# EAGLE design tm7_dock (EAGLE 9.6.2)
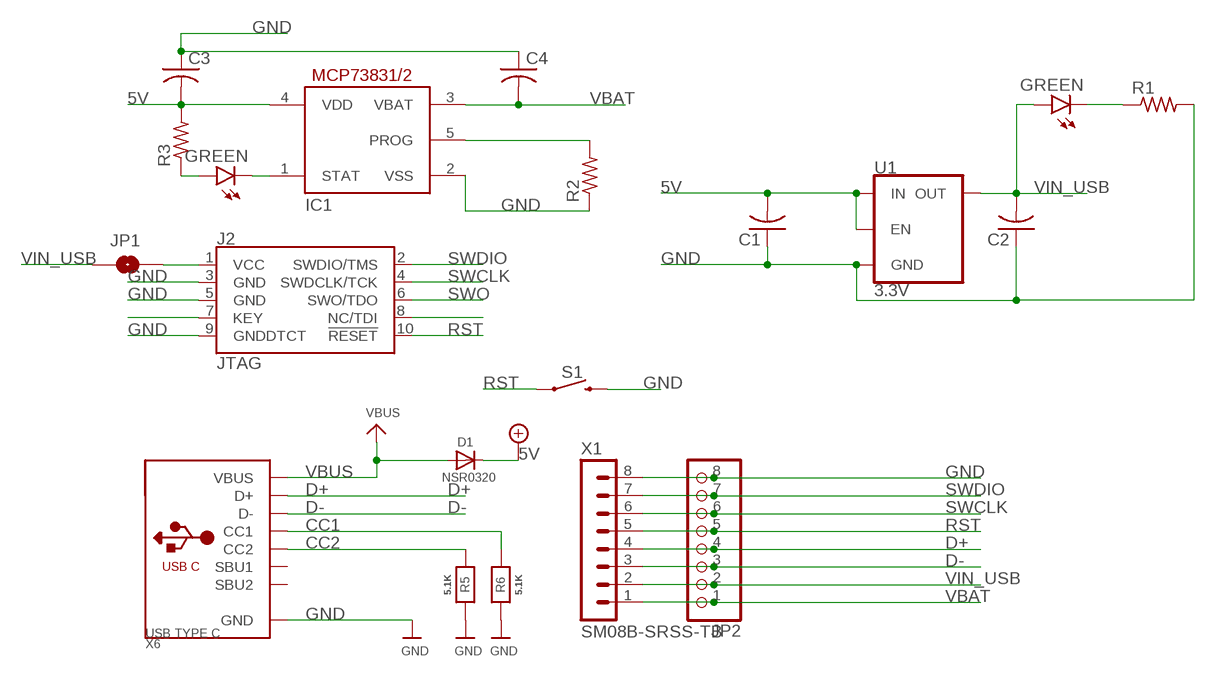
[diagram p0: schematic, sheet 1]

## Parts
C1  C-USC0603  [C0603]
C2  C-USC0603  [C0603]
C3  C-USC0603  [C0603]
C4  C-USC0603  [C0603]
D1  NSR0320  DIODE_SOD323MINI  [SOD-323_MINI]
D2  GREEN  LED-GREEN1206  [LED-1206]
D3  GREEN  LED-GREEN1206  [LED-1206]
IC1  MCP73831/OT  [SOT23-5L]
J2  JTAG  CORTEX_JTAG_DEBUG_SMD  [2X5-SMD-1.27MM]
JP1  JUMPER-SMT_2_NO_NO-SILK  [SMT-JUMPER_2_NO_NO-SILK]
JP2  PINHD-1X8LOCK  [1X08-LOCK]
R1  R-US_R0603  [R0603]
R2  R-US_R0603  [R0603]
R3  R-US_R0603  [R0603]
R5  5.1K  RESISTOR_0402NO  [_0402NO]
R6  5.1K  RESISTOR_0402NO  [_0402NO]
S1  MOMENTARY-SWITCH-SPST-SMD-5.2MM-TALL  [TACTILE_SWITCH_SMD_5.2MM]
U1  3.3V  V_REG_AP2112K-3.3V  [SOT23-5]
X1  SM08B-SRSS-TB  [SM08B-SRSS-TB]
X6  USB TYPE C  USB_C  [USB_C_CUSB31-CFM2AX-01-X]

## Nets
5V [power]: C1.2 C3.2 D1.C IC1.4(VDD) R3.2 U1.1(IN) U1.3(EN) ; supply symbol labelled +5V
CC1: R6.2 X6.A5(CC1)
CC2: R5.2 X6.B5(CC2)
D+: JP2.4 X1.4 X6.A6(D+) X6.B6(D+)
D-: JP2.3 X1.3 X6.A7(D-) X6.B7(D-)
GND [power]: C1.1 C2.1 C3.1 C4.1 IC1.2(VSS) J2.3(GND) J2.5(GND) J2.9(GNDDTCT) JP2.8 R1.2 R2.1 R5.1 R6.1 S1.3 U1.2(GND) X1.8 X6.A1B12(GND) X6.B1A12(GND)
N$1: D2.C R1.1
N$2: IC1.5(PROG) R2.2
N$3: D3.C IC1.1(STAT)
N$4: J2.7(KEY)
N$5: D3.A R3.1
N$6: J2.1(VCC) JP1.2
N$9: J2.8(NC/TDI)
RST: J2.10(!RESET) JP2.5 S1.1 X1.5
SWCLK: J2.4(SWDCLK/TCK) JP2.6 X1.6
SWDIO: J2.2(SWDIO/TMS) JP2.7 X1.7
SWO: J2.6(SWO/TDO)
VBAT: C4.2 IC1.3(VBAT) JP2.1 X1.1
VBUS [power]: D1.A X6.A4B9(VBUS) X6.B4A9(VBUS)
VIN_USB: C2.2 D2.A JP1.1 JP2.2 U1.5(OUT) X1.2
Unconnected: X6.A8(SBU1) X6.B8(SBU2)

## Library data of the parts
C1-C4 = adafruit:C-US: CAPACITOR, American symbol
D1 = microbuilder:DIODE: Diode SMA Model Volts Amps Type Vf Ir Digikey # Notes SSA34-E3 40V 3A Schottky 480mV @ 3A 200uA @ 40V SSA34-E3/61TGITR-ND CDBA120-G 20V 1A Schottky 500mV @ 1A 500uA @ 20V 641-1014-6-ND REEL MBRA210 10V 2A Schottky 350mV @ 2A 700uA @ 10V MBRA210LT3 SOD-123 Model Volts Amps Type Vf Ir Order # Notes BAT54T1G 30V 200mA Schottky 800mV @ 200mA 2uA @ 25V BAT54T1GOSTR-ND B0530W 30V 500mA Schottky 430mV @ 500mA 130uA @ 30V B0530W-FDICT-ND REEL MBR120 20V 1A Schottky 340mV @ 1A MBR120VLSFT1GOSCT-ND SOD-323 Model Volts Amps Type Vf Ir Order # Notes PMEG2005EJ 20V 500mA Schottky 355mV @ 500mA 568-4110-1-ND ZLLS410 10V 570mA Schottky 380mV @ 570mA ZLLS410CT-ND 1N4148WS 75V 150mA Silicon/Simple 1V 1N4148WSFSCT-ND REEL SOD-523 Model Volts Amps Type Vf Ir Order # Notes BAT54XV2 30V 200mA Schottky 0.8V @ 100mA BAT54XV2CT-ND TB751S 30V 30mA Schottky RB751S-40TE61CT-ND SOT23-R/W (R = Solder Paste/Reflow Ovens, W = Hand-Soldering) Model Volts Amps Type Vf Ir Order # Notes BAT54FILM 40V 300mA Schottky 497-7162-1-ND POWERDI-5 Model Volts Amps Type Vf Ir Order # Notes PDS560 60V 5A Schottky 670mV @ 5A 150uA @ 60V PDS560DICT-ND
D2 D3 = SparkFun-LED:LED-GREEN: Green SMD LED Used in manufacturing of various products at SparkFun Packages: 0603 - SMD 0603 package [Product Link] <http://www.futureelectronics.com/en/technologies/semiconductors/optoelectronics/leds/Pages/9894312-LTST-C190GKT.aspx?CrossPart=HSMG-C190&IM=0> LilyPad 1206 - SMD1206 LilyPad package [Product Link] <http://www.futureelectronics.com/en/Technologies/Product.aspx?ProductID=IN150NGHARVATEKCORPORATION2049943&IM=0> 1206 - SMD1206 package [Product Link] <http://www.futureelectronics.com/en/technologies/semiconductors/optoelectronics/leds/Pages/8315665-LTST-C150KGKT.aspx?IM=0> 1206 Bottom Mount -SMD 1206 Bottom Mount [Product Link] <http://www.digikey.com/product-detail/en/lite-on-inc/LTST-C230KGKT/160-1456-1-ND/386854> SparkFun Products: Pro Mini 328 -5V <https://www.sparkfun.com/products/821> RedBoard <https://www.sparkfun.com/products/12757> MP3 Trigger <https://www.sparkfun.com/products/13720> Makey Makey <https://www.sparkfun.com/products/11076>; PROD_ID: DIO-00862
IC1 = adafruit:MCP73831: MCP73831/2 Miniature Single-Cell, Fully Integrated Li-Ion, Li-Polymer Charge Management Controllers. Nice and small simple lipoly charge controller, with adjustable current and status output (LED) http://www.ladyada.net/library/pcb/eaglelibrary.html
J2 = SparkFun-Connectors:CORTEX_JTAG_DEBUG: Cortex Debug Connector - 10 pin Supports JTAG debug, Serial Wire debug, and Serial Wire Viewer. PTH and SMD connector options available. General Connector Information <http://infocenter.arm.com/help/topic/com.arm.doc.faqs/attached/13634/cortex_debug_connectors.pdf> Products: PTH Connector <http://www.digikey.com/product-detail/en/cnc-tech/3220-10-0100-00/1175-1627-ND/3883661> -via Digi-Key SparkFun PSoc <https://www.sparkfun.com/products/13229> SparkFun T <https://www.sparkfun.com/products/13810>; PROD_ID: CONN-14503
JP1 = SparkFun-Jumpers:JUMPER-SMT_2_NO: Normally open jumper This jumper has two pads in close proximity to each other. Apply solder to close the connection. Round pads are easier to solder for beginners, but are a lot larger. SparkFun Product that uses the round pads: SparkFun EL Sequencer <https://www.sparkfun.com/products/12781>
JP2 = adafruit:PINHD-1X8: PIN HEADER
R1-R3 = adafruit:R-US_: RESISTOR, American symbol
R5 R6 = microbuilder:RESISTOR: Resistors For new designs, use the packages preceded by an '_' character since they are more reliable: The following footprints should be used on most boards: _0402 - Standard footprint for regular board layouts _0603 - Standard footprint for regular board layouts _0805 - Standard footprint for regular board layouts _1206 - Standard footprint for regular board layouts For extremely tight-pitch boards where space is at a premium, the following 'micro-pitch' footprints can be used (smaller pads, no silkscreen outline, etc.): _0402MP - Micro-pitch footprint for very dense/compact boards _0603MP - Micro-pitch footprint for very dense/compact boards _0805MP - Micro-pitch footprint for very dense/compact boards _1206MP - Micro-pitch footprint for very dense/compact boards
S1 = SparkFun-Switches:MOMENTARY-SWITCH-SPST: Momentary Switch (Pushbutton) - SPST Normally-open (NO) SPST momentary switches (buttons, pushbuttons). Variants PTH-12MM - 12mm square, through-hole Momentary Pushbutton Switch - 12mm Square <https://www.sparkfun.com/products/9190> (COM-09190) PTH-6.0MM, PTH-6.0MM-KIT - 6.0mm square, through-hole Mini Pushbutton Switch <https://www.sparkfun.com/products/97> (COM-00097) KIT package intended for soldering kit's - only one side of pads' copper is exposed. PTH-RIGHT-ANGLE-KIT - Right-angle, through-hole Right Angle Tactile Button <https://www.sparkfun.com/products/10791> - Used on SparkFun BigTime Watch Kit <https://www.sparkfun.com/products/11734> SMD-12MM - 12mm square, surface-mount Tactile Button - SMD (12mm) <https://www.sparkfun.com/products/12993> (COM-12993) Used on SparkFun PicoBoard <https://www.sparkfun.com/products/11888> SMD-4.5MM - 4.5mm Square Trackball Switch Used on SparkFun Blackberry Trackballer Breakout <https://www.sparkfun.com/products/13169> SMD-4.6MMX2.8MM - 4.60mm x 2.80mm, surface mount Used on SparkFun Pro Micro - RP2040 <https://www.sparkfun.com/products/17717> SMD-5.2MM, SMD-5.2-REDUNDANT - 5.2mm square, surface-mount Mini Pushbutton Switch - SMD <https://www.sparkfun.com/products/8720> (COM-08720) Used on Arduino Pro Mini <https://www.sparkfun.com/products/11114> REDUNDANT package connects both switch circuits together SMD-6.0X3.5MM - 6.0 x 3.5mm, surface mount Momentary Reset Switch SMD <https://www.sparkfun.com/products/8229> (COM-08229) SMD-6.2MM-TALL - 6.2mm square, surface mount Tactile Button - SMD (6mm) <https://www.sparkfun.com/products/12992> Used on SparkFun Digital Sandbox <https://www.sparkfun.com/products/12651> SMD-RIGHT-ANGLE - Right-angle, surface mount Used on SparkFun Block for Intel® Edison - Arduino <https://www.sparkfun.com/products/13036>; PROD_ID: SWCH-14139
U1 = SparkFun-IC-Power:V_REG_AP2112: AP2112 - 600mA CMOS LDO Regulator w/ Enable The AP2112 is CMOS process low dropout linear regulator with enable function, the regulator delivers a guaranteed 600mA (min.) continuous load current. Features Output Voltage Accuracy: ±1.5% Output Current: 600mA (Min.) Foldback Short Current Protection: 50mA Enable Function to Turn ON/OFF VOUT Low Dropout Voltage (3.3V): 250mV (Typ.) @IOUT=600mA Excellent Load Regulation: 0.2%/A (Typ.) Excellent Line Regulation: 0.02%/V (Typ.) Low Quiescent Current: 55μA (Typ.) Low Standby Current: 0.01μA (Typ.) Low Output Noise: 50μVRMS PSRR: 100Hz -65dB, 1kHz -65dB OTSD Protection Stable with 1.0μF Flexible Cap: Ceramic, Tantalum and Aluminum Electrolytic Operation Temperature Range: -40°C to 85°C ESD: MM 400V, HBM 4000V; PROD_ID: VREG-12457
X1 = con-JST:SM08B-SRSS: JST SH series header 1.00mm pitch disconnectable crimp style connectors, horizontal (side entry type), 8 pins
X6 = microbuilder:USB_C: USB Type-C USB 2.0 Connector

## Net classes
1 power: width 0.254 mm

## Board
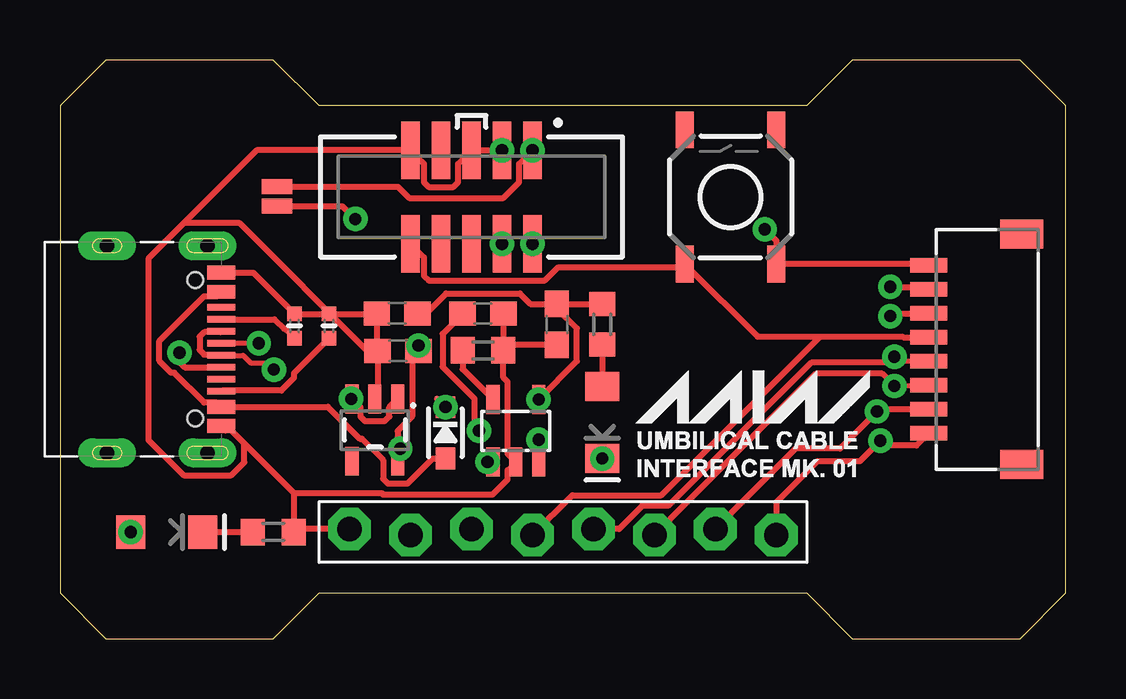
[diagram p1: board, top side]
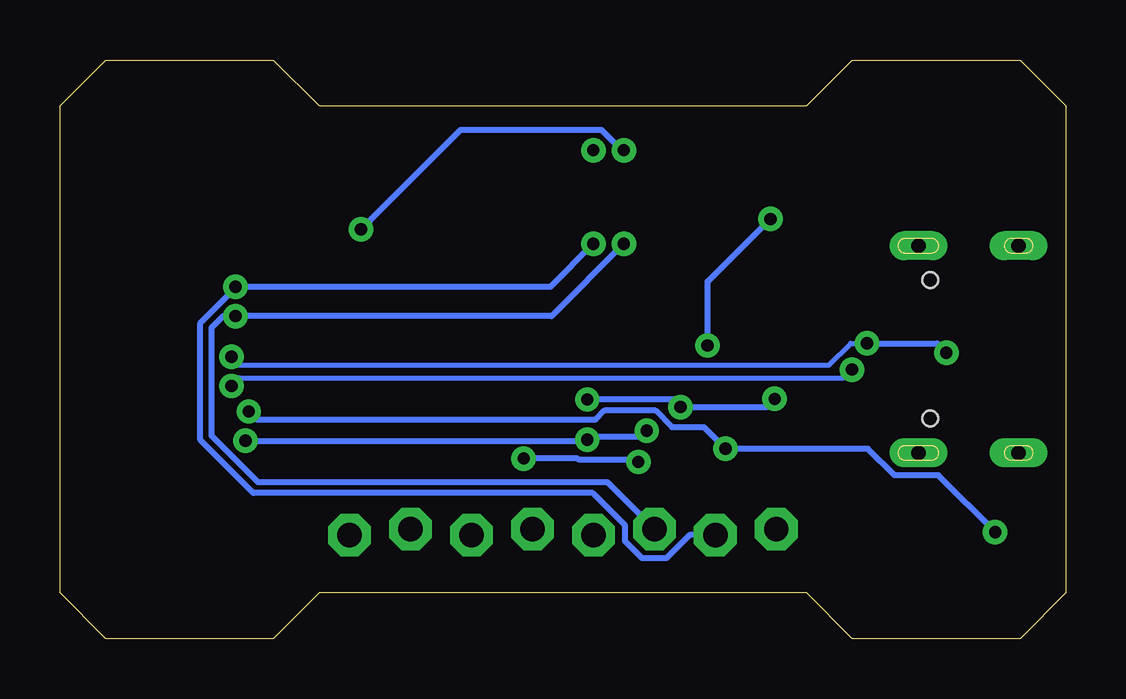
[diagram p2: board, bottom side, seen from below]

Size 41.91 x 24.13 mm. Coordinates in mm from the lower left corner, seen from the top.
Outline: 0,1.9 1.91,0 8.89,0 10.79,1.9 31.11,1.9 33.02,0 40,0 41.91,1.9 41.91,22.22 40,24.13 33.02,24.13 31.11,22.22 10.79,22.22 8.89,24.13 1.91,24.13 0,22.22 0,1.9
Copper layers (1*16): Top 0.035mm / dielectric 1.5mm / Bottom 0.035mm
Design rules "SparkFun": minimum track width 8mil, minimum drill 20mil, track to track 8mil, track to pad 8mil, pad to pad 8mil, via to via 8mil, smd to smd 8mil, copper to edge 10mil, drill to drill 8mil, minimum pad ring 12mil, minimum via ring 10mil, stop-mask expansion 4mil, vias tented up to drill 25mil, thermal gap 10mil

### Footprints (pad centres in the part's own frame; a part is rotated, then mirrored left to right if it is on the bottom)
C0603 = smd 1.1 x 1: 1 -0.85,0; 2 0.85,0
SOD-323_MINI = smd 0.9 x 0.8: A 1.07,0; C -1.07,0
LED-1206 = smd 1.2 x 1.4: A -1.5,0; C 1.5,0
SOT23-5L = smd 0.55 x 1.2: 1 -0.95,-1.3; 2 0,-1.3; 3 0.95,-1.3; 4 0.95,1.3; 5 -0.95,1.3
2X5-SMD-1.27MM = smd 0.76 x 2.4: 1 2.54,1.95; 2 2.54,-1.95; 3 1.27,1.95; 4 1.27,-1.95; 5 0,1.95; 6 0,-1.95; 7 -1.27,1.95; 8 -1.27,-1.95; 9 -2.54,1.95; 10 -2.54,-1.95
SMT-JUMPER_2_NO_NO-SILK = smd 0.635 x 1.27: 1 -0.406,0; 2 0.406,0
1X08-LOCK = drill 1.016 pad 1.778 octagon: 1 -8.89,0.127; 2 -6.35,-0.127; 3 -3.81,0.127; 4 -1.27,-0.127; 5 1.27,0.127; 6 3.81,-0.127; 7 6.35,0.127; 8 8.89,-0.127
R0603 = smd 1 x 1.1: 1 -0.85,0; 2 0.85,0
_0402NO = smd 0.6 x 0.6: 1 -0.508,0; 2 0.508,0
TACTILE_SWITCH_SMD_5.2MM = smd 1.524 x 0.762: 1 -2.794,1.905; 2 2.794,1.905; 3 -2.794,-1.905; 4 2.794,-1.905
SOT23-5 = smd 0.55 x 1.2: 1 -0.95,-1.3; 2 0,-1.3; 3 0.95,-1.3; 4 0.95,1.3; 5 -0.95,1.3
SM08B-SRSS-TB = smd 0.6 x 1.55: 1 3.5,0; 2 2.5,0; 3 1.5,0; 4 0.5,0; 5 -0.5,0; 6 -1.5,0; 7 -2.5,0; 8 -3.5,0 | smd 1.2 x 1.8: M1 4.8,3.875; M2 -4.8,3.875
USB_C_CUSB31-CFM2AX-01-X = smd 0.575 x 1.15: A1B12 -3.2,3.545; A4B9 -2.4,3.545; B1A12 3.2,3.545; B4A9 2.4,3.545 | smd 0.275 x 1.15: A5 -1.25,3.545; A6 -0.25,3.545; A7 0.25,3.545; A8 1.25,3.545; B5 1.75,3.545; B6 0.75,3.545; B7 -0.75,3.545; B8 -1.75,3.545 | drill 0.6 pad 1 long: M1 -4.32,2.97; M2 4.32,2.97; M3 -4.32,-1.21; M4 4.32,-1.21 | hole 0.65: 2.89,2.47; -2.89,2.47

### Placement (x,y rotation side)
C1  14.05,13.56 0 top
C2  14.08,12 0 top
C3  20.71,13.11 90 top
C4  17.62,13.56 180 top
D1  16.06,8.59 270 top
D2  4.45,4.45 0 top
D3  22.59,9.01 270 top
IC1  18.99,8.67 0 top
J2  17.14,18.42 0 top
JP1  9.05,18.44 90 top
JP2  20.96,4.45 180 top
R1  8.89,4.45 0 top
R2  17.62,12.02 180 top
R3  22.59,13.11 90 top
R5  11.21,13.04 270 top
R6  9.77,13.04 270 top
S1  27.94,18.42 90 top
U1  13.12,8.7 180 top
X1  36.19,12.07 270 top
X6  3.18,12.07 270 top

### Tracks (layer width: path | path; a pad name or v marks a point on that pad's centre or on a via)
5V  (via drill 0.51)
  Top 0.254: 15.71,10 D1.C | IC1.4 v19.94,9.97 21.54,11.57 21.54,12.94 20.71,13.77 C3.2 | C3.2 R3.2 | v12.13,10 U1.3 12.51,9.65 12.51,9.26 12.71,9.07 13.53,9.07 13.72,9.26 13.72,9.65 U1.1 | C1.2 15.25,13.56 16.08,14.39 19.16,14.39 19.6,13.96 C3.2
  Bottom 0.254: v12.13,10 12.48,9.65 D1.C 16.38,9.97 v19.94,9.97
  other vias: 16.06,9.66
CC1
  Top 0.254: R6.2 9.39,12.91 9.34,12.91 8.93,13.31 X6.A5
CC2
  Top 0.254: X6.B5 6.75,10.35 9.22,10.35 9.75,10.87 9.75,11.06 R5.2
D+  (via drill 0.51)
  Top 0.203: X1.4 34.95,11.56 v34.77,11.75 | v8.28,12.31 X6.A6
  Top 0.254: v4.98,11.92 4.98,11.54 5.2,11.31 X6.B6 | 34.59,11.58 v34.77,11.75 34.52,11.51 31.31,11.51 25.34,5.54 24.26,5.54 23.29,4.57 JP2.4
  Bottom 0.203: v34.77,11.75 34.42,11.41 9.87,11.41 8.97,12.31 v8.28,12.31
  Bottom 0.254: v8.28,12.31 5.37,12.31 v4.98,11.92
D-  (via drill 0.51)
  Top 0.203: X6.A7 7.63,11.81 7.95,11.5 8.63,11.5 v8.91,11.22 | v34.77,10.53 34.8,10.56 X1.3
  Top 0.254: X6.B7 6.69,12.78 6.01,12.78 5.82,12.59 5.82,12.04 6.01,11.85 6.69,11.85 X6.A7 | v34.77,10.53 34.25,11.05 31.5,11.05 JP2.3
  Bottom 0.203: v8.91,11.22 9.25,10.88 34.42,10.88 v34.77,10.53
GND  (via drill 0.51)
  Top 0.254: X6.A1B12 8.05,15.26 R6.1 R5.1 13.18,13.54 C1.1 13.2,12.04 C2.1 | C2.1 13.23,10.11 U1.2 | R2.1 18.71,12.26 C3.1 | C4.1 R2.1 | R2.1 18.47,10.88 18.65,10.7 18.65,7.71 IC1.2 18.65,7.02 18.65,6.63 18.03,6.01 13.47,6.01 13.4,6.08 9.74,6.08 | JP2.8 9.87,4.57 R1.2 9.74,6.08 | X6.B1A12 6.91,8.68 7.14,8.68 7.68,8.13 | 7.68,8.13 9.74,6.08 | X1.8 36.14,15.62 S1.3 29.85,16.59 v29.37,17.07 | J2.3 J2.5 16.59,19.8 16.59,19.03 16.39,18.83 15.36,18.83 15.17,19.03 15.17,19.8 15.06,19.91 J2.9 8.2,20.36 5.15,17.32 | 7.68,8.13 7.68,7.36 7.14,6.81 5.15,6.81 3.68,8.28 3.68,15.85 5.15,17.32 | C2.1 12.81,12 7.49,17.32 5.15,17.32
  Bottom 0.254: J2.3 18.5,20.36 19.34,21.2 25.23,21.2 v29.37,17.07
  other vias: 18.42,20.36
N$1
  Top 0.254: D2.C R1.1
N$2
  Top 0.254: R2.2 16.77,11.24 IC1.5
N$3  (via drill 0.51)
  Top 0.254: IC1.1 v17.81,7.37
  Bottom 0.254: D3.C 20.34,7.51 20.29,7.46 17.9,7.46 v17.81,7.37
  other vias: 22.59,7.51
N$5
  Top 0.254: R3.1 D3.A
N$6  (via drill 0.51)
  Top 0.254: JP1.2 14.08,18.85 14.54,18.38 18.47,18.38 19.13,19.03 19.13,19.8 J2.1
  other vias: 19.68,20.36
RST
  Top 0.254: JP2.5 21.35,5.98 25.06,5.98 31.67,12.59 | X1.5 35.14,12.56 35.11,12.59 31.67,12.59 | 31.67,12.59 29.06,12.59 26.16,15.49 | S1.1 26.16,15.49 | J2.10 15.17,15.9 15.17,15.13 15.36,14.93 20.2,14.93 20.76,15.49 26.16,15.49
SWCLK  (via drill 0.51)
  Top 0.254: v34.59,13.45 34.71,13.56 X1.6
  Bottom 0.254: J2.4 21.43,13.45 v34.59,13.45 35.11,13.45 35.6,12.96 35.6,8.47 33.66,6.53 19.1,6.53 JP2.6
  other vias: 18.42,16.46
SWDIO  (via drill 0.51)
  Top 0.254: v34.59,14.67 36.09,14.67 X1.7
  Bottom 0.254: J2.2 21.48,14.67 v34.59,14.67 34.59,14.63 36.06,13.17 36.06,8.28 33.85,6.07 19.71,6.07 18.36,4.72 18.36,4.07 17.65,3.35 16.64,3.35 15.68,4.32 JP2.7
  other vias: 19.68,16.46
VBAT  (via drill 0.51)
  Top 0.254: v17.46,8.67 17.27,8.86 17.27,10.01 15.94,11.33 15.94,12.71 16.77,13.54 C4.2 | JP2.1 29.85,5.69 31.55,7.4 33.32,7.4 v34.18,8.25 34.39,8.05 35.68,8.05 X1.1 | IC1.3 v19.94,8.3 | v19.94,8.3
  Bottom 0.254: v34.18,8.25 19.99,8.25 v19.94,8.3 19.94,8.33 19.85,8.43 17.7,8.43 v17.46,8.67
VBUS
  Top 0.254: D1.A 15.53,7.51 14.48,6.47 13.66,6.47 13.46,6.66 13.46,7.45 12.58,8.33 12.5,8.33 11.16,9.66 X6.B4A9 6.54,9.85 6.01,9.85 4.77,11.09 4.63,11.09 4.14,11.58 4.14,12.41 6.01,14.28 6.54,14.28 X6.A4B9
VIN_USB  (via drill 0.51)
  Top 0.254: 14.07,7.81 14.07,8.66 14.67,9.26 14.67,11.74 C2.2 v14.93,12.22 | 14.07,7.81 U1.5 | v14.18,7.92 14.07,7.81 | X1.2 34.14,9.56 v34.04,9.47 32.5,7.93 30.66,7.93 JP2.2 | JP1.1 11.77,18.03 v12.31,17.5
  Bottom 0.254: D2.A 5.31,6.81 7.14,6.81 8.25,7.92 v14.18,7.92 15.08,8.82 16.41,8.82 17.1,9.51 19.23,9.51 19.6,9.14 33.71,9.14 v34.04,9.47 | 14.93,14.9 14.93,14.87 | v14.93,12.22 14.93,14.75 14.93,14.87 | v12.31,17.5 14.93,14.87
  other vias: 2.95,4.45